# Altium schematic sheet I2C_MB.SchDoc
size A4
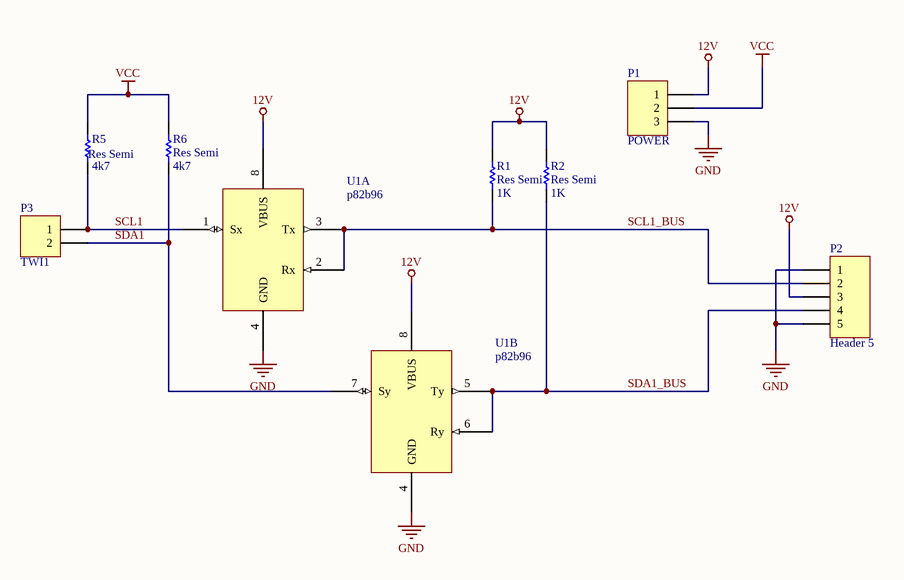
[diagram p0: I2C_MB.SchDoc]

## Parts
P1  POWER  [HDR1X3]
P2  Header 5  [HDR1X5]
P3  TWI1  [HDR1X2]
R1  Res Semi  value 1K  [AXIAL-0.5]
R2  Res Semi  value 1K  [AXIAL-0.5]
R5  Res Semi  value 4k7  [AXIAL-0.5]
R6  Res Semi  value 4k7  [AXIAL-0.5]
U1  p82b96  [SOIC8]  (parts A,B of 2)

## Nets
12V: P1.1 P2.3 R1.2 R2.2 U1.8(VBUS)
GND: P1.3 P2.1 P2.5 U1.4(GND)
VCC: P1.2 R5.2 R6.2
SCL1: P3.1 R5.1 U1.1(Sx)
SCL1_BUS: P2.2 R1.1 U1.2(Rx) U1.3(Tx)
SDA1: P3.2 R6.1 U1.7(Sy)
SDA1_BUS: P2.4 R2.1 U1.5(Ty) U1.6(Ry)

## Library data of the parts
P1 = Header 3: Header, 3-Pin; LatestRevisionDate: 17-Jul-2002; LatestRevisionNote: Re-released for DXP Platform.; Publisher: Altium Limited
P2 = Header 5: Header, 5-Pin; LatestRevisionDate: 17-Jul-2002; LatestRevisionNote: Re-released for DXP Platform.; Publisher: Altium Limited
P3 = Header 2: Header, 2-Pin; LatestRevisionDate: 17-Jul-2002; LatestRevisionNote: Re-released for DXP Platform.; Publisher: Altium Limited
R1 R2 R5 R6 = Res Semi: Semiconductor Resistor; Published: 8-Jun-2000; LatestRevisionDate: 17-Jul-2002; LatestRevisionNote: Re-released for DXP Platform.; PackageReference: AXIAL-0.5; Publisher: Altium Limited